# EasyEDA schematic RejsaCAN v3.4 - Schematic.json
TITLE: RejsaCAN  (new USB type-C); REV: 3.4; Date: 2023-08-25; Sheet: 1/1; Drawn By: MagnusT
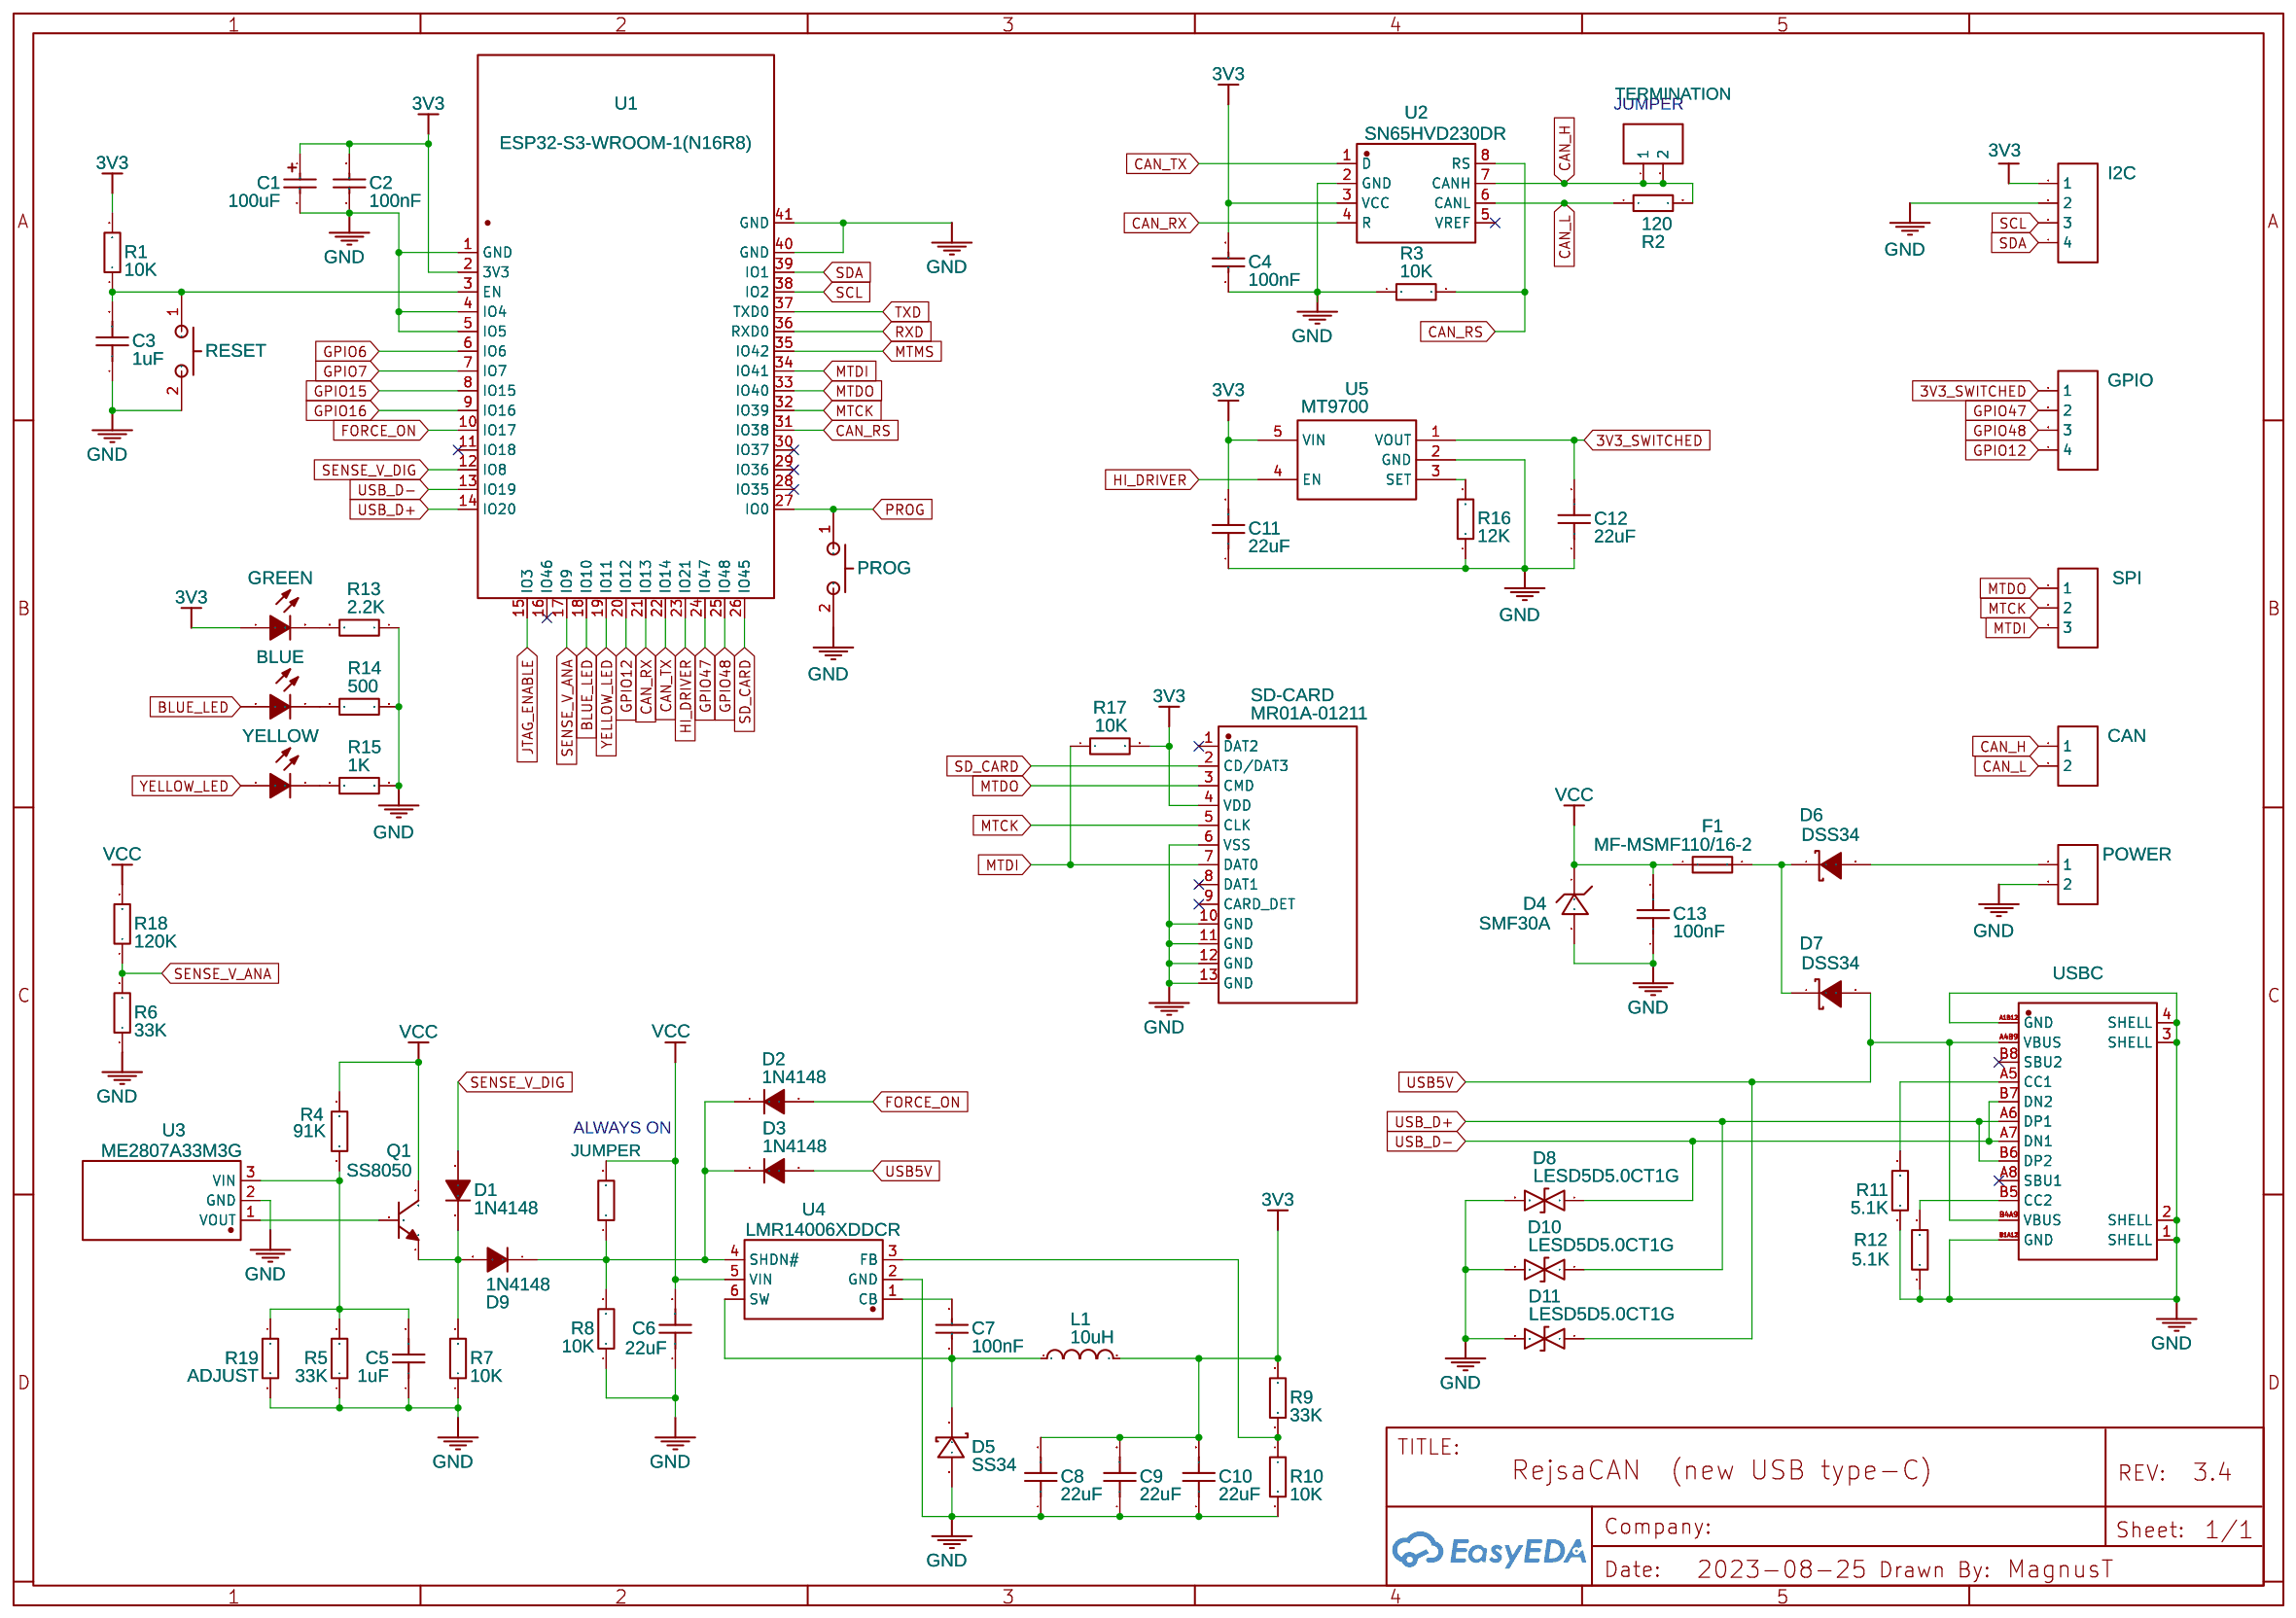
[diagram p0: schematic sheet]

## Parts
BLUE  19-217/BHC-ZL1M2RY/3T  [LED0603-R-RD]
C1  100uF  [CAP-SMD_L3.5-W2.8]
C2  100nF  [C0402_NEW]
C3  1uF  [C0402]
C4  100nF  [C0402_NEW]
C5  1uF  [C0402]
C6  22uF  [C0805]
C7  100nF  [C0402_NEW]
C8  22uF  [C0603]
C9  22uF  [C0603]
C10  22uF  [C0603]
C11  22uF  [C0603]
C12  22uF  [C0603]
C13  100nF  [C0402]
CAN  HDR-M-2.54_1x2  [HDR-M-2.54_1X2]
D1  1N4148  [SOD-323_L1.8-W1.3-LS2.5-RD]
D2  1N4148  [SOD-323_L1.8-W1.3-LS2.5-RD]
D3  1N4148  [SOD-323_L1.8-W1.3-LS2.5-RD]
D4  SMF30A  [SOD-123_L2.8-W1.8-LS3.7-RD]
D5  SS34  [DO-214AC_L4.3-W2.7-LS5.3-RD]
D6  DSS34  [SOD-123_L2.8-W1.8-LS3.7-RD]
D7  DSS34  [SOD-123_L2.8-W1.8-LS3.7-RD]
D8  LESD5D5.0CT1G  [SOD-523_L1.2-W0.8-LS1.6-BI]
D9  1N4148  [SOD-323_L1.8-W1.3-LS2.5-RD]
D10  LESD5D5.0CT1G  [SOD-523_L1.2-W0.8-LS1.6-BI]
D11  LESD5D5.0CT1G  [SOD-523_L1.2-W0.8-LS1.6-BI]
F1  MF-MSMF110/16-2  [F1812]
GPIO  HDR-M-2.54_1x4  [HDR-M-2.54_1X4]
GREEN  19-217/GHC-YR1S2/3T  [LED0603-R-RD]
I2C  HDR-M-2.54_1x4  [HDR-M-2.54_1X4]
JUMPER  -  [R0402]
L1  10uH  [IND-SMD_L6.0-W6.0_SLP6028S]
POWER  HDR-M-2.54_1x2  [HDR-M-2.54_1X2]
PROG  GT-TC029B-H025-L1N  [SW-SMD_L3.9-W2.9-P4.15-LS5.0]
Q1  SS8050  [SOT-23-3_L2.9-W1.3-P1.90-LS2.4-BR]
R1  10K  [R0402]
R2  120  [R1206]
R3  10K  [R0402]
R4  91K  [R0402]
R5  33K  [R0402]
R6  33K  [R0402]
R7  10K  [R0402]
R8  10K  [R0402]
R9  33K  [R0402]
R10  10K  [R0402]
R11  5.1K  [R0402]
R12  5.1K  [R0402]
R13  2.2K  [R0402]
R14  500  [R0402]
R15  1K  [R0402]
R16  12K  [R0402]
R17  10K  [R0402]
R18  120K  [R0402]
R19  ADJUST  [R0402]
RESET  GT-TC029B-H025-L1N  [SW-SMD_L3.9-W2.9-P4.15-LS5.0]
SD-CARD  MR01A-01211  [TF-SMD_MR01A-01211]
SPI  HDR-M-2.54_1x3  [HDR-M-2.54_1X3]
TERMINATION  HDR-M-2.54_1x2  [HDR-M-2.54_1X2]
U1  ESP32-S3-WROOM-1(N16R8)  [WIRELM-SMD_ESP32-S3-WROOM-1]
U2  SN65HVD230DR  [SOIC-8_L4.9-W3.9-P1.27-LS6.0-BL]
U3  ME2807A33M3G  [SOT-23_L2.9-W1.3-P1.90-LS2.4-BR]
U4  LMR14006XDDCR  [TSOT-23-6_L2.9-W1.6-P0.95-LS2.8-BL]
U5  MT9700  [SOT-23-5_L3.0-W1.7-P0.95-LS2.8-BR]
USBC  GT-USB-7010ASV  [USB-C-SMD_G-SWITCH_GT-USB-7010ASV]
YELLOW  19-213/Y2C-CQ2R2L/3T(CY)  [LED0603-R-RD]

## Library data of the parts
BLUE = 19-217/BHC-ZL1M2RY/3T: Supplier: LCSC; Manufacturer: EVERLIGHT; Supplier Part: C72041; JLCPCB Part Class: Basic Part; Package Display: No
C1 = TAJB107K006RNJ: Supplier: LCSC; Manufacturer: AVX; Supplier Part: C16133; JLCPCB Part Class: Basic Part; Package Display: No
C2 C4 C7 = CL05B104KO5NNNC: Supplier: LCSC; Manufacturer: SAMSUNG; Supplier Part: C1525; JLCPCB Part Class: Basic Part; Package Display: No
C3 C5 = CL05A105KA5NQNC: Supplier: LCSC; Manufacturer: SAMSUNG; Supplier Part: C52923; JLCPCB Part Class: Basic Part; Package Display: No
C6 = CL21A226MAYNNNE: Supplier: LCSC; Supplier Part: C602037; Manufacturer: Samsung Electro-Mechanics; Contributor: LCSC; JLCPCB Part Class: Extended Part
C8-C12 = CL10A226MQ8NRNC: Supplier: LCSC; Manufacturer: SAMSUNG; Supplier Part: C59461; JLCPCB Part Class: Basic Part; Package Display: No
C13 = CL05B104KB54PNC: Supplier: LCSC; Supplier Part: C307331; Manufacturer: Samsung Electro-Mechanics; Contributor: LCSC; JLCPCB Part Class: Basic Part
CAN POWER TERMINATION = HDR-M-2.54_1x2: Supplier Part: C124375; Supplier: LCSC; Contributor: LCEDA_Lib
D1-D3 D9 = 1N4148WS T4: Supplier: LCSC; Manufacturer: CJ; Supplier Part: C2128; JLCPCB Part Class: Basic Part; Package Display: No
D4 = SMF30A_C366558: Supplier: LCSC; Supplier Part: C366558; Manufacturer: DOWO; Contributor: LCSC; JLCPCB Part Class: Extended Part
D5 = SS34_C8678: Supplier: LCSC; Manufacturer: MDD; Supplier Part: C8678; JLCPCB Part Class: Basic Part; Package Display: No
D6 D7 = DSS34: Supplier: LCSC; Manufacturer: STARSEA; Supplier Part: C84632; JLCPCB Part Class: Extended Part
D8 D10 D11 = LESD5D5.0CT1G: Supplier: LCSC; Supplier Part: C383211; Manufacturer: Leshan Radio; Contributor: LCSC; JLCPCB Part Class: Extended Part
F1 = MF-MSMF110/16-2: Supplier: LCSC; Supplier Part: C210834; Manufacturer: BOURNS; Contributor: LCSC; JLCPCB Part Class: Extended Part
GPIO I2C = HDR-M-2.54_1x4: Supplier Part: C124378; Supplier: LCSC; Contributor: LCEDA_Lib
GREEN = 19-217/GHC-YR1S2/3T: Supplier: LCSC; Manufacturer: EVERLIGHT; Supplier Part: C72043; JLCPCB Part Class: Basic Part; Package Display: No
JUMPER = 0402WGF3092TCE: Contributor: LCSC
L1 = SLP6028S100MTT: Supplier: LCSC; Supplier Part: C254862; Manufacturer: Sunltech Tech; Contributor: LCSC; JLCPCB Part Class: Extended Part
PROG RESET = GT-TC029B-H025-L1N: Supplier: LCSC; Supplier Part: C843669; Manufacturer: G-Switch; Contributor: LCSC; JLCPCB Part Class: Extended Part; Package Display: No
Q1 = SS8050_C2150: Supplier: LCSC; Manufacturer: CJ; Supplier Part: C2150; JLCPCB Part Class: Basic Part; Package Display: No
R1 R3 R7 R8 R10 = 0402WGF1002TCE: Supplier: LCSC; Manufacturer: UniOhm; Supplier Part: C25744; JLCPCB Part Class: Basic Part; Package Display: No
R2 = RTT061200FTP: Supplier: LCSC; Manufacturer: RALEC; Contributor: LCSC; Supplier Part: C159715; JLCPCB Part Class: Extended Part; Package Display: No
R4 R19 = 0402WGF9102TCE: Supplier: LCSC; Manufacturer: UniOhm; Supplier Part: C4147; JLCPCB Part Class: Extended Part
R5 R6 R9 = 0402WGF3302TCE: Supplier: LCSC; Manufacturer: UniOhm; Supplier Part: C25779; JLCPCB Part Class: Basic Part
R11 R12 = 0402WGF5101TCE: Supplier: LCSC; Manufacturer: UniOhm; Supplier Part: C25905; JLCPCB Part Class: Basic Part
R13 = 0402WGF2201TCE: Supplier: LCSC; Manufacturer: UniOhm; Supplier Part: C25879; JLCPCB Part Class: Basic Part; Package Display: No
R14 = 0402WGF1001TCE: Supplier: LCSC; Manufacturer: UniOhm; Manufacturer Part: 0402WGF4700TCE; Supplier Part: C25117; JLCPCB Part Class: Basic Part; Package Display: No
R15 = 0402WGF1001TCE: Supplier: LCSC; Manufacturer: UniOhm; Supplier Part: C11702; JLCPCB Part Class: Basic Part; Package Display: No
R16 = 0402WGF1202TCE: Supplier: LCSC; Manufacturer: UniOhm; Supplier Part: C25752; JLCPCB Part Class: Basic Part
R17 = 0402WGF1002TCE: Supplier: LCSC; Manufacturer: UniOhm; Supplier Part: C25744; JLCPCB Part Class: Basic Part
R18 = 0402WGF1203TCE: Supplier: LCSC; Manufacturer: UniOhm; Supplier Part: C25750; JLCPCB Part Class: Basic Part
SD-CARD = MR01A-01211: Supplier: LCSC; Supplier Part: C479742; Manufacturer: ATOM(爱特姆); Contributor: LCSC; JLCPCB Part Class: Extended Part
SPI = HDR-M-2.54_1x3: Supplier Part: C180248; Supplier: LCSC; Contributor: LCEDA_Lib
U1 = ESP32-S3-WROOM-1(N16R8): Supplier: LCSC; Supplier Part: C2913202; Manufacturer: ESPRESSIF(乐鑫); link: https://atta.szlcsc.com/upload/public/pdf/source/20220705/4E799F39581577F766659887F738A439.pdf; JLCPCB Part Class: Extended Part; Contributor: lcsc
U2 = SN65HVD230DR: Supplier: LCSC; Manufacturer: TI; Supplier Part: C12084; JLCPCB Part Class: Basic Part; Package Display: No
U3 = ME2807A33M3G: Supplier: LCSC; Supplier Part: C236755; Manufacturer: Nanjing Micro One Elec; Contributor: LCSC; JLCPCB Part Class: Extended Part
U4 = LMR14006XDDCR: Supplier: LCSC; Supplier Part: C478074; Manufacturer: Texas Instruments; Contributor: LCSC; JLCPCB Part Class: Extended Part
U5 = MT9700: Supplier: LCSC; Manufacturer: AEROSEMI; Supplier Part: C89855; JLCPCB Part Class: Extended Part
USBC = GT-USB-7010ASV: Contributor: lcsc; Supplier: LCSC; Supplier Part: C2988369; Manufacturer: G-Switch(品赞); JLCPCB Part Class: Extended Part; link: https://lcsc.com/eda_search?q=C2988369&%26type=1&ref=editor
YELLOW = 19-213/Y2C-CQ2R2L/3T(CY): Supplier: LCSC; Manufacturer: EVERLIGHT; Supplier Part: C72038; JLCPCB Part Class: Basic Part; Package Display: No

## Nets
3V3: C1.1 C2.2 C4.2 C8.2 C9.2 C10.2 C11.2 GREEN.1(A) I2C.1 L1.2 R1.2 R9.2 R17.2 SD-CARD.4(VDD) U1.2(3V3) U2.3(VCC) U5.5(VIN)
3V3_SWITCHED: C12.2 GPIO.1 U5.1(VOUT)
GND: C1.2 C2.1 C3.1 C4.1 C5.1 C6.1 C8.1 C9.1 C10.1 C11.1 C12.1 C13.1 D4.2 D5.2(A) D8.2 D10.2 D11.2 I2C.2 POWER.2 PROG.2 R3.1 R5.1 R6.1 R7.1 R8.1 R10.2 R11.1 R12.1 R13.1 R14.2 R15.2 R16.1 R19.2 RESET.2 SD-CARD.6(VSS) SD-CARD.10(GND) SD-CARD.11(GND) SD-CARD.12(GND) SD-CARD.13(GND) U1.1(GND) U1.4(IO4) U1.5(IO5) U1.40(GND) U1.41(GND) U2.2(GND) U3.2(GND) U4.2(GND) U5.2(GND) USBC.1(SHELL) USBC.2(SHELL) USBC.3(SHELL) USBC.4(SHELL) USBC.A1B12(GND) USBC.B1A12(GND)
VCC: C6.2 C13.2 D4.1 F1.1 JUMPER.2 Q1.3(C) R4.2 R18.2 U4.5(VIN)
BLUE_LED: BLUE.1(A) U1.18(IO10)
CAN_H: CAN.1 R2.2 TERMINATION.1 TERMINATION.2 U2.7(CANH)
CAN_L: CAN.2 R2.1 U2.6(CANL)
CAN_RS: R3.2 U1.31(IO38) U2.8(RS)
CAN_RX: U1.21(IO13) U2.4(R)
CAN_TX: U1.22(IO14) U2.1(D)
FORCE_ON: D2.2(A) U1.10(IO17)
GPIO6: U1.6(IO6)
GPIO7: U1.7(IO7)
GPIO12: GPIO.4 U1.20(IO12)
GPIO15: U1.8(IO15)
GPIO16: U1.9(IO16)
GPIO47: GPIO.2 U1.24(IO47)
GPIO48: GPIO.3 U1.25(IO48)
HI_DRIVER: U1.23(IO21) U5.4(EN)
JTAG_ENABLE: U1.15(IO3)
MTCK: SD-CARD.5(CLK) SPI.2 U1.32(IO39)
MTDI: R17.1 SD-CARD.7(DAT0) SPI.3 U1.34(IO41)
MTDO: SD-CARD.3(CMD) SPI.1 U1.33(IO40)
MTMS: U1.35(IO42)
PROG: PROG.1 U1.27(IO0)
RXD: U1.36(RXD0)
SCL: I2C.3 U1.38(IO2)
SD_CARD: SD-CARD.2(CD/DAT3) U1.26(IO45)
SDA: I2C.4 U1.39(IO1)
SENSE_V_ANA: R6.2 R18.1 U1.17(IO9)
SENSE_V_DIG: D1.2(A) U1.12(IO8)
TXD: U1.37(TXD0)
USB5V: D3.2(A) D7.2(A) D11.1 USBC.A4B9(VBUS) USBC.B4A9(VBUS)
USB_D+: D10.1 U1.14(IO20) USBC.A6(DP1) USBC.B6(DP2)
USB_D-: D8.1 U1.13(IO19) USBC.A7(DN1) USBC.B7(DN2)
YELLOW_LED: U1.19(IO11) YELLOW.1(A)
Net-(BLUE-2): BLUE.2(C) R14.1
Net-(C3-2): C3.2 R1.1 RESET.1 U1.3(EN)
Net-(C5-2): C5.2 R4.1 R5.2 R19.1 U3.3(VIN)
Net-(C7-1): C7.1 D5.1(K) L1.1 U4.6(SW)
Net-(C7-2): C7.2 U4.1(CB)
Net-(D1-1): D1.1(K) D9.2(A) Q1.2(E) R7.2
Net-(D2-1): D2.1(K) D3.1(K) D9.1(K) JUMPER.1 R8.2 U4.4(SHDN#)
Net-(D6-1): D6.1(K) D7.1(K) F1.2
Net-(D6-2): D6.2(A) POWER.1
Net-(GREEN-2): GREEN.2(C) R13.2
Net-(Q1-1): Q1.1(B) U3.1(VOUT)
Net-(R9-1): R9.1 R10.1 U4.3(FB)
Net-(R11-2): R11.2 USBC.A5(CC1)
Net-(R12-2): R12.2 USBC.B5(CC2)
Net-(R15-1): R15.1 YELLOW.2(C)
Net-(R16-2): R16.2 U5.3(SET)

Not connected (* = marked no-connect by the designer): SD-CARD 1(DAT2)* 8(DAT1)* 9(CARD_DET)*; U1 11(IO18)* 16(IO46)* 28(IO35)* 29(IO36)* 30(IO37)*; U2 5(VREF)*; USBC A8(SBU1)* B8(SBU2)*

## Notes on the sheet
- JUMPER
- ALWAYS ON
